# Altium schematic sheet PMIC.SchDoc
size A3; SheetNumber: 2; SheetTotal: 8; SPICEModelCacheDPLPYRRR: <root> / <DocumentId>DPLPYRRR</DocumentId> / <CacheFrame Number="0"> / <Model Name="emk105bj105_v-f" Kind="CKT"> / <Text>* EMK105BJ105_V-F     SPICE MODEL  ( General Type ) / *-------------------------------------------------------------------------------------------------------- / * Model Generated by TAIYO YUDEN Corporation (http://www.ty-top.com) / * Version 1.0 / * TAIYO YUDEN Control No. 170508_130520 / * Copyright(c) 2012 TAIYO YUDEN CO.,LTD. All Rights Reserved. / *-------------------------------------------------------------------------------------------------------- / * / * Products Name : Multilayer Ceramic Capacitors / * / * Characteristics : / *     Capacitance : 1 uF , Rated Voltage : 16V , TCC : X5R / *     Case Size : 1.0 x 0.5 / 0.039 x 0.02 [mm/inch] , Thickness : 0.5 / 0.02 [mm/inch] / *     (Conditions: Temperature = 25 degC , DC Bias Current/Voltage = 0A / 0V) / * / * Frequency Range : 40Hz - 3GHz / * / * External Node Assignments : / * / *  1  o---| |---o  2 / * / *-------------------------------------------------------------------------------------------------------- / .SubCkt EMK105BJ105_V-F 1 2 / **************************** / C0 1 110 0.68309u / Cm 1 101 0.26053u / C1 101 102 0.94076u / Rc1 101 102 1.9029k / C2 102 103 0.66707u / Rc2 102 103 120.36 / C3 103 110 0.57203u / Rc3 103 110 2.1097 / C2m 1 301 0.1871u / C21 301 302 3.2494u / Rc21 301 302 1.1117k / C22 302 303 2.1014u / Rc22 302 303 1.484k / C23 303 304 2.1172u / Rc23 303 304 1.3876k / C24 304 305 0.75729u / Rc24 304 305 332.59 / C25 305 306 0.94401u / Rc25 305 306 249.09 / C26 306 307 0.34674u / Rc26 306 307 28.352 / C27 307 308 0.37158u / Rc27 307 308 19.989 / C28 308 309 0.17933u / Rc28 308 309 31.748 / C29 309 110 0.016445u / Rc29 309 110 1.0592 / Rp0 1 110 100Meg / L0 110 120 0.2216n / Lm 120 130 0.1509n / L1 120 121 0.12659n / RL1 121 130 0.85161 / L2 120 122 0.15996n / RL2 122 130 0.42469 / L3 120 123 7.9543n / RL3 123 130 0.54643m / CR 120 124 0.24334u / LR 124 125 0.090738n / RR 125 130 68.076m / CL 130 140 2.7354p / LL 130 140 0.10762n / RL 130 140 50.614 / Rs 140 2 7.5416m / **************************** / .ends EMK105BJ105_V-F</Text> / </Model> / </CacheFrame> / </root>
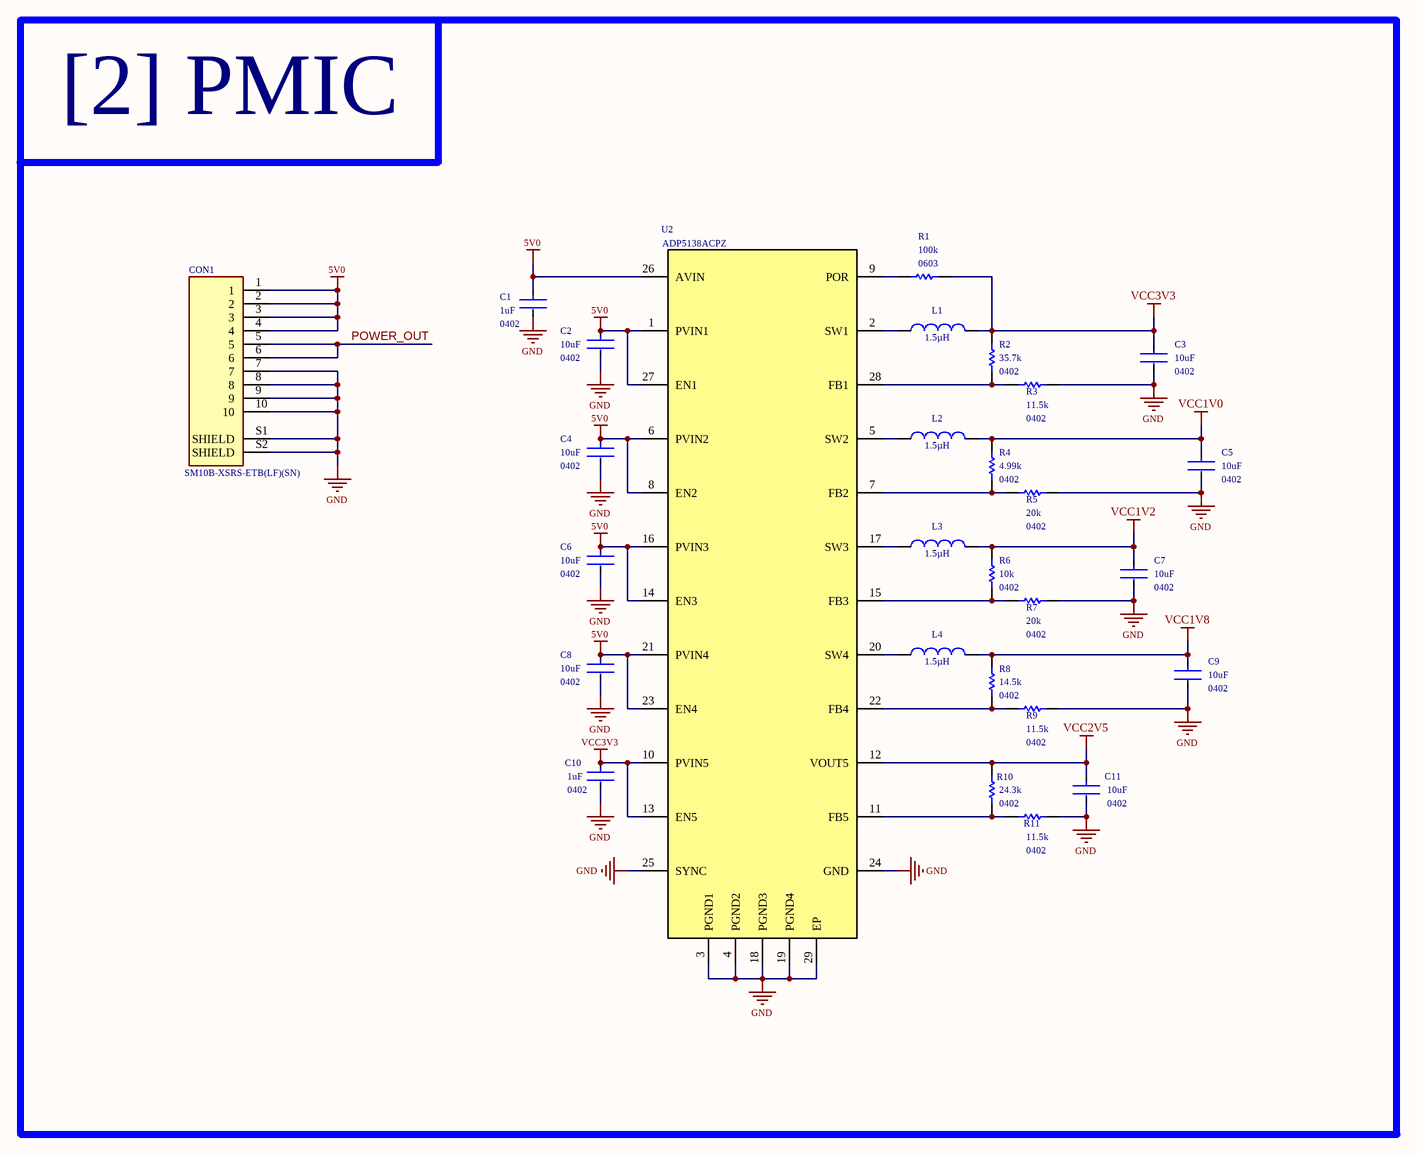
[diagram p0: PMIC.SchDoc]

## Parts
C1  Case/Package: 0402  Capacitance: 1uF  [FP-0402-L_1_0_0_05-W_0_5-IPC_A]  (hidden comment: EMK105BJ105KV-F)
C2  Case/Package: 0402  Capacitance: 10uF  [FP-GRM155-0_2-IPC_B]  (hidden comment: GRM155R60J106ME44D)
C3  Case/Package: 0402  Capacitance: 10uF  [FP-GRM155-0_2-IPC_B]  (hidden comment: GRM155R60J106ME44D)
C4  Case/Package: 0402  Capacitance: 10uF  [FP-GRM155-0_2-IPC_B]  (hidden comment: GRM155R60J106ME44D)
C5  Case/Package: 0402  Capacitance: 10uF  [FP-GRM155-0_2-IPC_B]  (hidden comment: GRM155R60J106ME44D)
C6  Case/Package: 0402  Capacitance: 10uF  [FP-GRM155-0_2-IPC_B]  (hidden comment: GRM155R60J106ME44D)
C7  Case/Package: 0402  Capacitance: 10uF  [FP-GRM155-0_2-IPC_B]  (hidden comment: GRM155R60J106ME44D)
C8  Case/Package: 0402  Capacitance: 10uF  [FP-GRM155-0_2-IPC_B]  (hidden comment: GRM155R60J106ME44D)
C9  Case/Package: 0402  Capacitance: 10uF  [FP-GRM155-0_2-IPC_B]  (hidden comment: GRM155R60J106ME44D)
C10  Case/Package: 0402  Capacitance: 1uF  [FP-0402-L_1_0_0_05-W_0_5-IPC_A]  (hidden comment: EMK105BJ105KV-F)
C11  Case/Package: 0402  Capacitance: 10uF  [FP-GRM155-0_2-IPC_B]  (hidden comment: GRM155R60J106ME44D)
CON1  SM10B-XSRS-ETB(LF)(SN)  [SM10B-XSRS-ETB]
L1  Inductance: 1.5µH  [WE-TPC-3816-S]  (hidden comment: 744031001)
L2  Inductance: 1.5µH  [WE-TPC-3816-S]  (hidden comment: 744031001)
L3  Inductance: 1.5µH  [WE-TPC-3816-S]  (hidden comment: 744031001)
L4  Inductance: 1.5µH  [WE-TPC-3816-S]  (hidden comment: 744031001)
R1  value 100k  Package: 0603  [RESC1608X55X30ML20T20]  (hidden comment: ERA3AEB104V)
R2  Parameter 1: 35.7k  Parameter 2: 0402  [RESC1005X40X25NL05T10]  (hidden comment: RC0402FR-0735K7L)
R3  Parameter 3: 11.5k  Parameter 4: 0402  [RESC1005X40X25NL05T10]  (hidden comment: RC0402FR-0711K5L)
R4  Parameter 3: 4.99k  Parameter 4: 0402  [RESC1005X40X25NL05T10]  (hidden comment: RC0402FR-074K99L)
R5  Parameter 3: 20k  Parameter 4: 0402  [RESC1005X40X25NL05T10]  (hidden comment: RC0402FR-0720KL)
R6  Parameter 3: 10k  Parameter 4: 0402  [RESC1005X40X25NL05T10]  (hidden comment: RC0402FR-0710KL)
R7  Parameter 3: 20k  Parameter 4: 0402  [RESC1005X40X25NL05T10]  (hidden comment: RC0402FR-0720KL)
R8  Parameter 3: 14.5k  Parameter 4: 0402  [RESC1005X40N]  (hidden comment: RN73H1ETTP1452F25)
R9  Parameter 3: 11.5k  Parameter 4: 0402  [RESC1005X40X25NL05T10]  (hidden comment: RC0402FR-0711K5L)
R10  Parameter 3: 24.3k  Parameter 4: 0402  [RESC1005X40X25NL05T10]  (hidden comment: RC0402FR-0724K3L)
R11  Parameter 3: 11.5k  Parameter 4: 0402  [RESC1005X40X25NL05T10]  (hidden comment: RC0402FR-0711K5L)
U2  ADP5138ACPZ  [CP_28_5]

## Blocks framed on the sheet
[2] PMIC: C1-C11 CON1 L1-L4 R1-R11 U2

## Nets
5V0: C1.1 C2.1 C4.1 C6.1 C8.1 CON1.1 CON1.2 CON1.3 CON1.4 U2.1(PVIN1) U2.6(PVIN2) U2.8(EN2) U2.14(EN3) U2.16(PVIN3) U2.21(PVIN4) U2.23(EN4) U2.26(AVIN) U2.27(EN1)
GND: C1.2 C2.2 C3.2 C4.2 C5.2 C6.2 C7.2 C8.2 C9.2 C10.2 C11.2 CON1.7 CON1.8 CON1.9 CON1.10 CON1.S1(SHIELD) CON1.S2(SHIELD) R3.2 R5.2 R7.2 R9.2 R11.2 U2.3(PGND1) U2.4(PGND2) U2.18(PGND3) U2.19(PGND4) U2.24(GND) U2.25(SYNC) U2.29(EP)
VCC1V0: C5.1 L2.2 R4.2
VCC1V2: C7.1 L3.2 R6.2
VCC1V8: C9.1 L4.2 R8.2
VCC2V5: C11.1 R10.2 U2.12(VOUT5)
VCC3V3: C3.1 C10.1 L1.2 R1.2 R2.2 U2.10(PVIN5) U2.13(EN5)
POWER_OUT: CON1.5 CON1.6
NetL1_1: L1.1 U2.2(SW1)
NetL2_1: L2.1 U2.5(SW2)
NetL3_1: L3.1 U2.17(SW3)
NetL4_1: L4.1 U2.20(SW4)
NetR1_1: R1.1 U2.9(POR)
NetR2_1: R2.1 R3.1 U2.28(FB1)
NetR4_1: R4.1 R5.1 U2.7(FB2)
NetR6_1: R6.1 R7.1 U2.15(FB3)
NetR8_1: R8.1 R9.1 U2.22(FB4)
NetR10_1: R10.1 R11.1 U2.11(FB5)

## Library data of the parts
C1 C10 = CMP-14477-000104-2: None; Tolerance: 10%; Voltage Rating: 16V; Dielectric: X5R; Packaging: Tape and Reel; Depth: 0.5mm; Mount: Surface Mount; Thickness: 0.022inch; Package Quantity: 1; Min Operating Temperature: -55°C; Series: M; Voltage Rating (DC): 16V; Termination: SMD/SMT; Number of Pins: 2; Case Code (Imperial): 0402; Length: 1mm; Halogen Free: Halogen Free; Case Code (Metric): 1005; Width: 0.02inch; RoHS Compliant: Yes; Radiation Hardening: No; Max Operating Temperature: 85°C; Height: 0.5mm; Construction: Flat
C2-C9 C11 = CMP-2000-05265-2: CAP CER 10UF 6.3V X5R 0402; Tolerance: 20%; Voltage Rating: 6.3V; Voltage Rating (DC): 6.3V; Voltage: 6.3V; Case Code (Metric): 1005; REACH SVHC: No SVHC; Min Operating Temperature: -55°C; Height: 0.5mm; Dielectric: X5R; Depth: 0.5mm; Thickness: 0.022inch; Packaging: Tape and Reel; Length: 1mm; Mount: Surface Mount; Package Quantity: 10000; Lead Free: Lead Free; Termination: SMD/SMT; Max Operating Temperature: 85°C; Case Code (Imperial): 0402; Series: GRM; Width: 0.5mm; RoHS Compliant: Yes
CON1 = SM10B-XSRS-ETB(LF)(SN): Part_Number: J00001; Part_Name: Jumper; ID: 110; Mounting_Type: SMT; ComponentLink1Description: Datasheet
L1-L4 = CMP-0227-00364-1: SMD Shielded Tiny Power Inductor WE-TPC, L = 1.50 µH; PackageVersion: 2009; ComponentLink2Description: Datasheet; ComponentLink1URL: http://www.we-online.com; PackageDescription: SMD Inductor, 2-Leads, Body 3.8 x 3.8 mm; ComponentLink2URL: http://www.we-online.de/katalog/media/pdf/744031001.pdf; ComponentLink1Description: Manufacturer Link; DatasheetVersion: ver 6, Jan-2009; PackageReference: WE-TPC-3816-S
R1 = CMP-2000-00875-1: Manufacturer: Panasonic; Part Number: ERA3AEB104V
R2 = CMP-1011-00684-2: Manufacturer: Yageo / Phycomp; Part Number: RC0402FR-0735K7L
R3 R9 R11 = CMP-2002-07364-1: Manufacturer: Yageo / Phycomp; Part Number: RC0402FR-0711K5L
R4 = CMP-2002-07717-1: Manufacturer: Yageo / Phycomp; Part Number: RC0402FR-074K99L
R5 R7 = CMP-2002-07501-1: Manufacturer: Yageo / Phycomp; Part Number: RC0402FR-0720KL
R6 = CMP-2002-07353-1: Manufacturer: Yageo / Phycomp; Part Number: RC0402FR-0710KL
R10 = CMP-2002-07533-1: Manufacturer: Yageo; Part Number: RC0402FR-0724K3L
U2 = ADP5138ACPZ: No Description Available; Copyright: Copyright (C) 2021 Accelerated Designs. All rights reserved; RefDes: RefDes; Type: Type
R8 = RN73H1ETTP1452F25: Package: None; Price: None; Value: *; MP: RN73H1ETTP1452F25; Availability: Unavailable; Parameter 1: 14.5k; Parameter 2: 0402